# EAGLE design Capteurs (EAGLE 9.3.2)
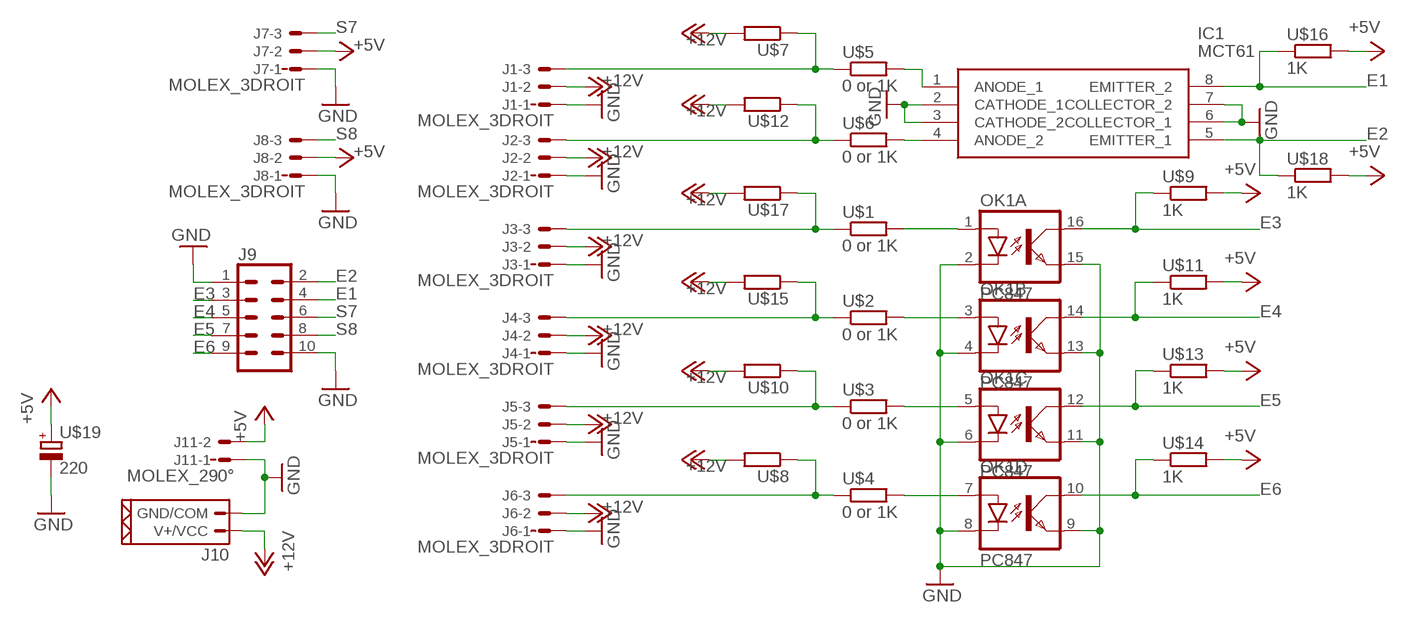
[diagram p0: schematic, sheet 1]

## Parts
IC1  MCT61  [DIP762W56P254L940H508Q8N]
J1  MOLEX_3DROIT  [CON_3_DROIT]
J2  MOLEX_3DROIT  [CON_3_DROIT]
J3  MOLEX_3DROIT  [CON_3_DROIT]
J4  MOLEX_3DROIT  [CON_3_DROIT]
J5  MOLEX_3DROIT  [CON_3_DROIT]
J6  MOLEX_3DROIT  [CON_3_DROIT]
J7  MOLEX_3DROIT  [CON_3_DROIT]
J8  MOLEX_3DROIT  [CON_3_DROIT]
J9  CON_5X2SHD  [2X5-SHROUDED]
J10  MOLEX_2_PUISS90°  [CON_2_PUISS_90°]
J11  MOLEX_290°  [CON_2_90°]
OK1  PC847  [DIL16]
U$1  0 or 1K  R1206R1206  [R1206]
U$2  0 or 1K  R1206R1206  [R1206]
U$3  0 or 1K  R1206R1206  [R1206]
U$4  0 or 1K  R1206R1206  [R1206]
U$5  0 or 1K  R1206R1206  [R1206]
U$6  0 or 1K  R1206R1206  [R1206]
U$7  NULL or 500  R1206R1206  [R1206]
U$8  NULL or 500  R1206R1206  [R1206]
U$9  1K  R1206R1206  [R1206]
U$10  NULL or 500  R1206R1206  [R1206]
U$11  1K  R1206R1206  [R1206]
U$12  NULL or 500  R1206R1206  [R1206]
U$13  1K  R1206R1206  [R1206]
U$14  1K  R1206R1206  [R1206]
U$15  NULL or 500  R1206R1206  [R1206]
U$16  1K  R1206R1206  [R1206]
U$17  NULL or 500  R1206R1206  [R1206]
U$18  1K  R1206R1206  [R1206]
U$19  220  CONDO3.5-8  [E3,5-8]

## Nets
+5V: J7.2 J8.2 J11.2 U$9.2 U$11.2 U$13.2 U$14.2 U$16.2 U$18.2 U$19.+
+12V: J1.2 J2.2 J3.2 J4.2 J5.2 J6.2 J10.P$2(V+/VCC) U$7.2 U$8.2 U$10.2 U$12.2 U$15.2 U$17.2
E1: IC1.8(EMITTER_2) J9.4 U$16.1
E2: IC1.5(EMITTER_1) J9.2 U$18.1
E3: J9.3 OK1.16(A:COL) U$9.1
E4: J9.5 OK1.14(B:COL) U$11.1
E5: J9.7 OK1.12(C:COL) U$13.1
E6: J9.9 OK1.10(D:COL) U$14.1
GND: IC1.2(CATHODE_1) IC1.3(CATHODE_2) IC1.6(COLLECTOR_1) IC1.7(COLLECTOR_2) J1.1 J2.1 J3.1 J4.1 J5.1 J6.1 J7.1 J8.1 J9.1 J9.10 J10.P$1(GND/COM) J11.1 OK1.2(A:C) OK1.4(B:C) OK1.6(C:C) OK1.8(D:C) OK1.9(D:EMIT) OK1.11(C:EMIT) OK1.13(B:EMIT) OK1.15(A:EMIT) U$19.-
N$1: OK1.1(A:A) U$1.2
N$2: OK1.3(B:A) U$2.2
N$3: OK1.5(C:A) U$3.2
N$4: OK1.7(D:A) U$4.2
N$9: J3.3 U$1.1 U$17.1
N$10: J4.3 U$2.1 U$15.1
N$11: IC1.1(ANODE_1) U$5.2
N$12: IC1.4(ANODE_2) U$6.2
N$15: J5.3 U$3.1 U$10.1
N$16: J6.3 U$4.1 U$8.1
N$17: J2.3 U$6.1 U$12.1
N$18: J1.3 U$5.1 U$7.1
S7: J7.3 J9.6
S8: J8.3 J9.8

## Library data of the parts
IC1 = AREA:MCT61: Optocoupler Dual Transistor PDIP8 Source: Datasheet <https://www.fairchildsemi.com/datasheets/MC/MCT61.pdf>; DESCRIPTION: Optocoupler Dual Transistor PDIP8; HEIGHT: 5.08mm; MANUFACTURER_NAME: Fairchild Semiconductor; MANUFACTURER_PART_NUMBER: MCT61; MOUSER_PART_NUMBER: 512-MCT61; MOUSER_PRICE-STOCK: https://www.mouser.com/Search/Refine.aspx?Keyword=512-MCT61; RS_PART_NUMBER: 7613552P; RS_PRICE-STOCK: http://befr.rs-online.com/web/p/products/7613552P
J1-J8 = AREA:MOLEX_3: CONNECTOR wire to board 2.54 mm (.1 inch) pitch header; MF: MOLEX; OC_FARNELL: unknown; OC_NEWARK: unknown
J9 = AREA:CON_5X2: Multi connection point. Often used as Generic Header-pin footprint for 0.1 inch spaced/style header connections For AVR SPI programming port, see special device with nice symbol: "AVR_SPI_PROG_5x2.dev" You can populate with any combo of single row headers, but if you'd like an exact match, check these: 2x5 AVR ICSP Male Header <https://www.sparkfun.com/products/778> (PRT-00778) 2x5 Pin Shrouded Header <https://www.sparkfun.com/products/8506> (PRT-08506) On any of the 0.1 inch spaced packages, you can populate with these: Break Away Headers - Straight <https://www.sparkfun.com/products/116> (PRT-00116) Break Away Male Headers - Right Angle <https://www.sparkfun.com/products/553> (PRT-00553) Female Headers <https://www.sparkfun.com/products/115> (PRT-00115) Break Away Headers - Machine Pin <https://www.sparkfun.com/products/117> (PRT-00117) Break Away Female Headers - Swiss Machine Pin <https://www.sparkfun.com/products/743> (PRT-00743) Special note: the shrouded connector mates well with our 5x2 ribbon cables: 2x5 Pin IDC Ribbon Cable <https://www.sparkfun.com/products/8535> (PRT-08535); PROD_ID: CONN-08671; SF_ID: PRT-08506
J10 = AREA:MOLEX_2_PUISS: Solid Header 3.96mm KK ,r/a,F/Lock,2w Molex KK Series, Series Number 41792, 3.96mm Pitch 2 Way 1 Row Right Angle PCB Header, Solder Termination, 7A Source: Datasheet <http://www.molex.com/webdocs/datasheets/pdf/en-us/0026605020_PCB_HEADERS.pdf>
J11 = AREA:MOLEX_2: CONNECTOR wire to board 2.54 mm (.1 inch) pitch header; MF: MOLEX; OC_FARNELL: 9731601; OC_NEWARK: unknown
OK1 = AREA:PC847: SHARP OPTO COUPLER; OC_FARNELL: 9707735; OC_NEWARK: unknown
U$1-U$18 = AREA:R1206
U$19 = AREA:CONDO

## Board
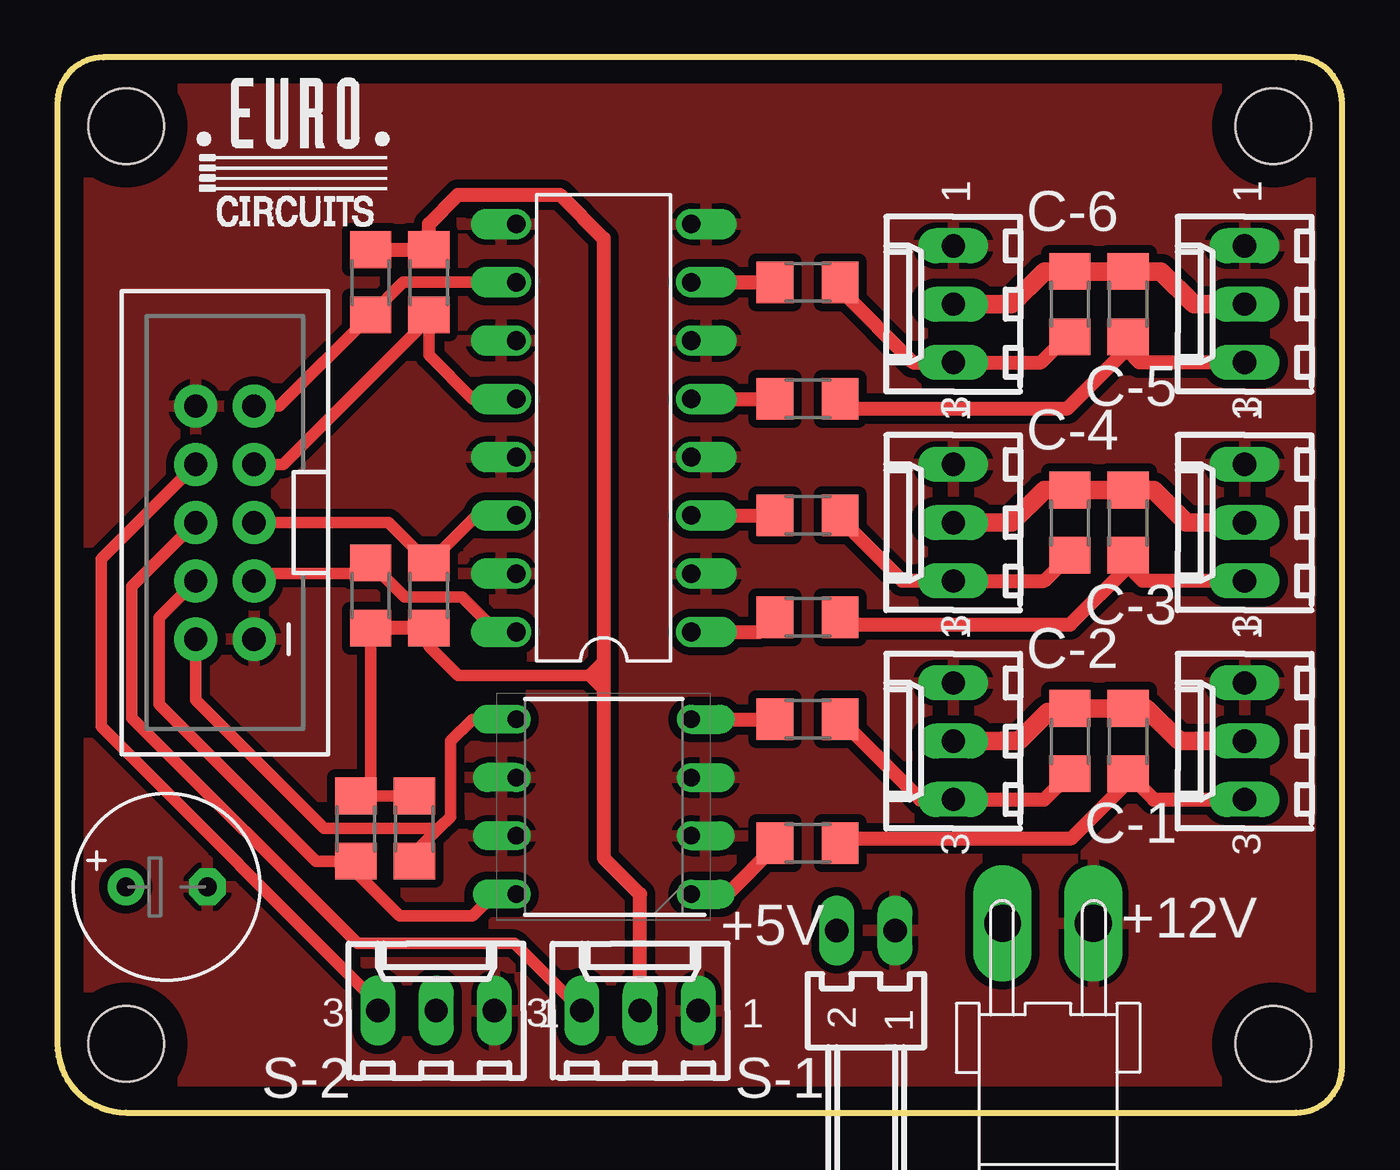
[diagram p1: board, top side]
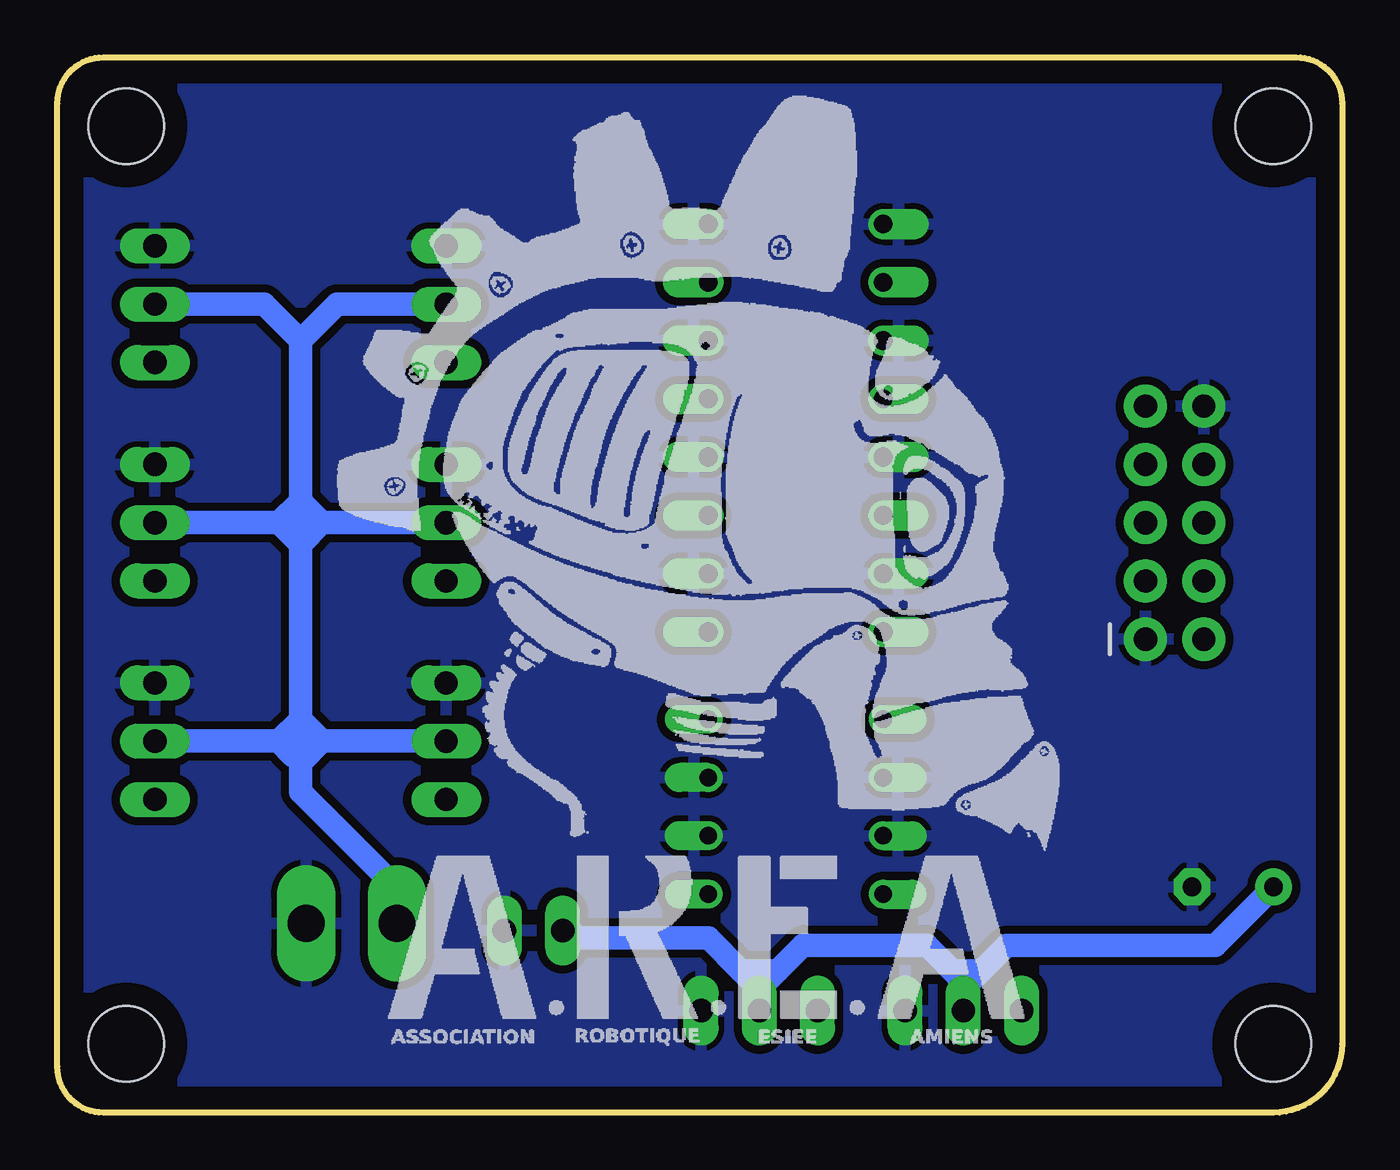
[diagram p2: board, bottom side, seen from below]

Size 56 x 46 mm. Coordinates in mm from the lower left corner, seen from the top.
Outline: 2,46 arc90 0,44 0,3 arc90 3,0 54,0 arc90 56,2 56,44 arc90 54,46 2,46
Copper layers (1*16): Top 0.035mm / dielectric 1.5mm / Bottom 0.035mm
Design rules "default *": minimum track width 10mil, minimum drill 0.35mm, track to track 14mil, track to pad 12mil, pad to pad 12mil, via to via 12mil, smd to smd 10mil, copper to edge 40mil, drill to drill 6mil, minimum pad ring 10mil, minimum via ring 8mil, stop-mask expansion 4mil, vias tented up to drill 0mil, thermal gap 10mil
Holes 3.3 mm at 53,3 3,3 53,43 3,43

### Footprints (pad centres in the part's own frame; a part is rotated, then mirrored left to right if it is on the bottom)
DIP762W56P254L940H508Q8N = drill 0.76 pad 1.16 offset: 1 -3.81,3.81; 2 -3.81,1.27; 3 -3.81,-1.27; 4 -3.81,-3.81; 5 3.81,-3.81; 6 3.81,-1.27; 7 3.81,1.27; 8 3.81,3.81
CON_3_DROIT = drill 1.016 long: 1 2.54,0; 2 0,0; 3 -2.54,0
2X5-SHROUDED = drill 1.016 pad 1.88: 1 -1.27,5.08; 2 1.27,5.08; 3 -1.27,2.54; 4 1.27,2.54; 5 -1.27,0; 6 1.27,0; 7 -1.27,-2.54; 8 1.27,-2.54; 9 -1.27,-5.08; 10 1.27,-5.08
CON_2_PUISS_90° = drill 1.6 pad 2.54 long: P$1 -1.98,0; P$2 1.98,0
CON_2_90° = drill 1.016 long: 1 1.27,0; 2 -1.27,0
DIL16 = drill 0.813 offset: 1 -8.89,-3.81; 2 -6.35,-3.81; 3 -3.81,-3.81; 4 -1.27,-3.81; 5 1.27,-3.81; 6 3.81,-3.81; 7 6.35,-3.81; 8 8.89,-3.81; 9 8.89,3.81; 10 6.35,3.81; 11 3.81,3.81; 12 1.27,3.81; 13 -1.27,3.81; 14 -3.81,3.81; 15 -6.35,3.81; 16 -8.89,3.81
R1206 = smd 1.6 x 1.803: 1 -1.422,0; 2 1.422,0
E3,5-8 = drill 0.813 pad 1.6: + -1.778,0 | drill 0.813 pad 1.6 octagon: - 1.778,0

### Placement (x,y rotation side)
IC1  23.81,13.34 180 top
J1  51.75,16.19 90 top
J2  39.05,16.19 90 top
J3  51.75,25.72 90 top
J4  39.05,25.72 90 top
J5  51.75,35.24 90 top
J6  39.05,35.24 90 top
J7  25.4,4.45 0 top
J8  16.51,4.45 0 top
J9  7.3,25.72 180 top
J10  43.18,8.26 180 top
J11  35.24,7.94 0 top
OK1  23.81,29.84 90 top
U$1  32.7,21.59 180 top
U$2  32.7,26.04 180 top
U$3  32.7,31.11 180 top
U$4  32.7,36.2 180 top
U$5  32.7,11.75 180 top
U$6  32.7,17.14 180 top
U$7  46.67,16.19 90 top
U$8  44.13,35.24 90 top
U$9  13.65,22.54 270 top
U$10  46.67,35.24 90 top
U$11  16.19,22.54 270 top
U$12  44.13,16.19 90 top
U$13  16.19,36.2 90 top
U$14  13.65,36.2 90 top
U$15  44.13,25.72 90 top
U$16  13.02,12.38 90 top
U$17  46.67,25.72 90 top
U$18  15.56,12.38 90 top
U$19  4.76,9.84 0 top

### Tracks (layer width: path | path; a pad name or v marks a point on that pad's centre or on a via)
+5V
  Top 0.508: U$9.2 13.65,14.44 U$16.2 U$18.2 | U$11.2 16.19,20.32 17.46,19.05 23.18,19.05 | 23.18,19.05 23.81,19.05 | 23.18,19.05 23.81,18.41 23.81,18.1 | 23.18,19.05 23.81,19.68
  Top 0.61: U$14.2 U$13.2 16.19,38.73 17.46,40.01 21.91,40.01 23.81,38.1 23.81,19.68 23.81,19.05 23.81,18.1 23.81,11.11 25.4,9.53 J7.2 | U$11.2 U$9.2
  Bottom 1.016: J11.2 33.66,7.94 33.34,7.62 27.62,7.62 26.19,6.19 | 26.19,6.19 25.4,5.4 | 25.4,5.4 J7.2 | 25.4,5.4 24.61,6.19 | 24.61,6.19 23.5,7.3 18.1,7.3 16.83,6.03 | 24.61,6.19 26.19,6.19 | U$19.+ 5.52,7.3 14.61,7.3 15.72,6.19 | 15.72,6.19 16.51,5.4 J8.2 16.51,5.71 16.83,6.03 | 15.72,6.19 16.67,6.19 16.83,6.03
+12V
  Top 0.813: J6.2 41.59,35.24 43.01,36.66 U$8.2 U$10.2 48.11,36.66 49.53,35.24 J5.2 | J4.2 41.59,25.72 43.01,27.14 U$15.2 U$17.2 47.79,27.14 49.21,25.72 J3.2 | J2.2 41.91,16.19 43.18,17.46 43.98,17.46 U$12.2 U$7.2 47.47,17.61 48.9,16.19 J1.2
  Bottom 1.016: J10.P$2 41.2,9.77 45.4,13.97 45.4,15.24 | 45.4,33.66 43.81,35.24 J6.2 | 45.4,33.66 46.99,35.24 J5.2 | 45.4,33.66 45.4,26.67 | 45.4,26.67 45.4,25.72 | 45.4,25.72 45.4,24.77 | 45.4,24.77 45.4,17.14 | 45.4,17.14 45.4,15.56 | 45.4,15.56 45.4,15.24 | J4.2 44.45,25.72 | 44.45,25.72 45.4,25.72 | J3.2 46.35,25.72 | 46.35,25.72 45.4,25.72 | 44.45,25.72 45.4,26.67 | 46.35,25.72 45.4,26.67 | 44.45,25.72 45.4,24.77 | 45.4,24.77 46.35,25.72 | J2.2 44.45,16.19 | 44.45,16.19 46.35,16.19 | 46.35,16.19 J1.2 | 44.45,16.19 45.4,15.24 | 45.4,15.56 45.72,15.56 46.35,16.19 | 46.35,16.19 45.4,17.14 | 45.4,17.14 44.45,16.19
E1
  Top 0.508: J9.4 4.45,21.59 4.45,17.8 11.28,10.96 U$16.1 13.02,10.48 14.92,8.57 18.1,8.57 19.05,9.53 IC1.8
E2
  Top 0.508: 16.63,12.38 11.63,12.38 6.03,17.98 J9.2 | 16.63,12.38 17.14,12.9 17.14,16.19 18.1,17.14 IC1.5 | U$18.1 15.56,11.31 16.63,12.38
E3
  Top 0.508: J9.3 8.89,23.5 13.18,23.5 U$9.1 15.14,22.48 17.64,22.48 19.17,20.95 OK1.16
E4
  Top 0.508: OK1.14 18.26,26.04 U$11.1 14.44,25.72 J9.5
E5
  Top 0.508: OK1.12 18.1,31.11 16.19,33.02 16.19,34.61 | 16.19,34.61 U$13.1 | 16.19,34.61 9.84,28.26 J9.7
E6
  Top 0.508: OK1.10 15.07,36.2 U$14.1 9.68,30.8 J9.9
GND
  pour Top: -6.67,49.85 -6.67,-3.81 66.99,-3.81 66.99,49.85
  pour Bottom: -7.62,47.62 -7.62,-6.67 67.63,-6.67 67.63,47.62
N$1
  Top 0.61: OK1.1 30.64,20.95 U$1.2
N$2
  Top 0.61: OK1.3 U$2.2
N$3
  Top 0.61: OK1.5 U$3.2
N$4
  Top 0.61: OK1.7 U$4.2
N$9
  Top 0.61: U$1.1 34.12,21.27 44.13,21.27 46.67,23.81 | 46.67,23.81 U$17.1 | J3.3 47.31,23.18 46.67,23.81
N$10
  Top 0.61: U$2.1 34.12,25.88 36.83,23.18 J4.3 43.01,23.18 U$15.1
N$11
  Top 0.61: U$5.2 31.28,11.6 29.21,9.53 IC1.1
N$12
  Top 0.61: IC1.4 U$6.2
N$15
  Top 0.61: U$3.1 34.12,30.7 44.03,30.7 46.67,33.34 U$10.1 46.67,33.19 47.16,32.7 J5.3
N$16
  Top 0.61: U$4.1 34.12,35.88 37.3,32.7 J6.3 42.86,32.7 43.98,33.82 U$8.1
N$17
  Top 0.61: U$12.1 43.01,13.65 J2.3 37.62,13.65 U$6.1
N$18
  Top 0.61: U$5.1 34.34,11.96 44.21,11.96 46.67,14.43 U$7.1 47.79,13.65 J1.3
S7
  Top 0.508: J7.3 19.93,7.38 13.08,7.38 3.25,17.21 3.25,22.93 J9.6
S8
  Top 0.508: J9.8 1.91,24.13 1.91,16.83 13.97,4.76 J8.3

### Text on the board
tNames: C-6 | C-5 | C-4 | C-3 | C-2 | C-1 | +12V | +5V | S-2 | S-1